# EAGLE schematic PineWoodDerby-Mega_Shield (EAGLE 7.2.0)
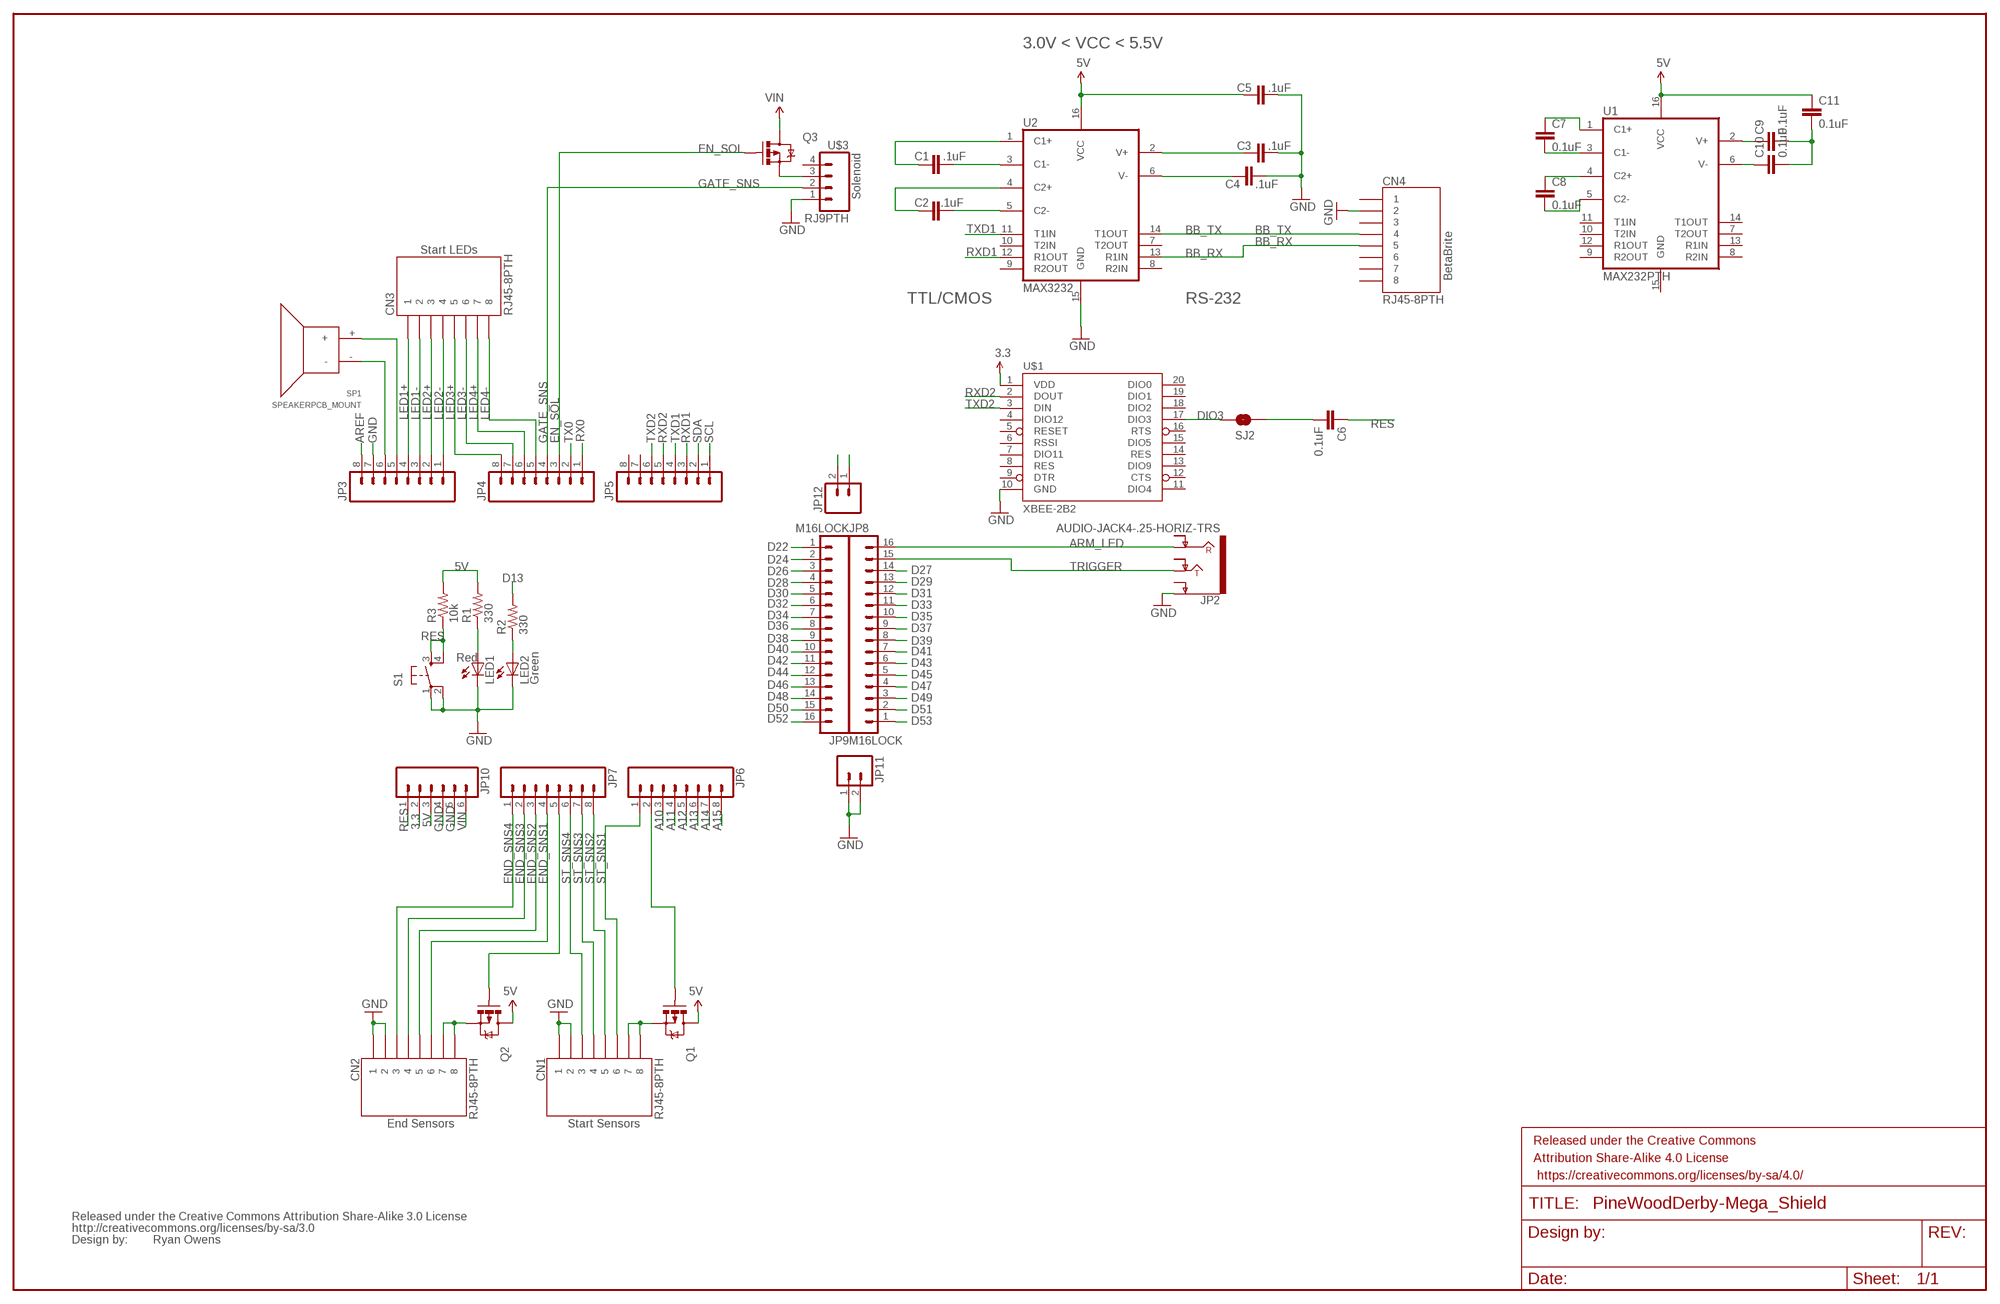
[diagram p0: schematic, sheet 1]

## Parts
C1  .1uF  CAP0402-CAP  [0402-CAP]
C2  .1uF  CAP0402-CAP  [0402-CAP]
C3  .1uF  CAP0402-CAP  [0402-CAP]
C4  .1uF  CAP0402-CAP  [0402-CAP]
C5  .1uF  CAP0402-CAP  [0402-CAP]
C6  0.1uF  CAP0402-CAP  [0402-CAP]
C7  0.1uF  0.1UF-50V-20%(PTH)KIT-EZ  [CAP-PTH-SMALL-KIT]
C8  0.1uF  0.1UF-50V-20%(PTH)KIT-EZ  [CAP-PTH-SMALL-KIT]
C9  0.1uF  0.1UF-50V-20%(PTH)KIT-EZ  [CAP-PTH-SMALL-KIT]
C10  0.1uF  0.1UF-50V-20%(PTH)KIT-EZ  [CAP-PTH-SMALL-KIT]
C11  0.1uF  0.1UF-50V-20%(PTH)KIT-EZ  [CAP-PTH-SMALL-KIT]
CN1  RJ45-8PTH  [RJ45-8]
CN2  RJ45-8PTH  [RJ45-8]
CN3  RJ45-8PTH  [RJ45-8]
CN4  RJ45-8PTH  [RJ45-8]
FRAME2  FRAME-LEDGER  [CREATIVE_COMMONS]
JP2  AUDIO-JACK4-.25-HORIZ-TRS  [AUDIO-JACK-.25-INCH-HORIZ-PTH]
JP3  M08LOCK  [1X08_LOCK]
JP4  M08LOCK  [1X08_LOCK]
JP5  M08LOCK  [1X08_LOCK]
JP6  M08LOCK  [1X08_LOCK]
JP7  M08LOCK  [1X08_LOCK]
JP8  M16LOCK  [1X16_LOCK]
JP9  M16LOCK  [1X16_LOCK]
JP10  M06LOCK  [1X06_LOCK]
JP11  M02LOCK  [1X02_LOCK]
JP12  M02LOCK  [1X02_LOCK]
LED1  Red  LED5MM  [LED5MM]
LED2  Green  LED5MM  [LED5MM]
Q1  MOSFET-PCHANNELFQP27P06  [TO220V]
Q2  MOSFET-PCHANNELFQP27P06  [TO220V]
Q3  MOSFET-PCHANNELFQP27P06  [TO220V]
R1  330  RESISTORPTH1  [AXIAL-0.3]
R2  330  RESISTORPTH1  [AXIAL-0.3]
R3  10k  RESISTORPTH1  [AXIAL-0.3]
S1  TAC_SWITCHPTH  [TACTILE-PTH]
SJ2  SOLDERJUMPERTRACE  [SJ_2S-TRACE]
SP1  SPEAKERPCB_MOUNT  [PCB_MOUNT_SPEAKER]
U1  MAX232PTH  [DIL16]
U2  MAX3232  MAX232SOIC16  [SO016]
U$1  XBEE-2B2  [XBEE-SILK]
U$2  CREATIVE_COMMONS  [CREATIVE_COMMONS]
U$3  RJ9PTH  [RJ9]

## Nets
3.3: JP10.2 U$1.1(VDD)
5V: C5.1 C11.1 JP10.3 Q1.2(D) Q2.2(D) R1.P$2 R3.P$2 U1.16(VCC) U2.16(VCC)
5V@1: JP12.1 JP12.2
A10: JP6.3
A11: JP6.4
A12: JP6.5
A13: JP6.6
A14: JP6.7
A15: JP6.8
AREF: JP3.8
ARM_LED: JP2.RING JP8.16
BB_RX: CN4.5 U2.13(R1IN)
BB_TX: CN4.4 U2.14(T1OUT)
C1+: C1.1 U2.1(C1+)
C1-: C1.2 U2.3(C1-)
C2+: C2.1 U2.4(C2+)
C2-: C2.2 U2.5(C2-)
D13: R2.P$2
D22: JP9.1
D24: JP9.2
D26: JP9.3
D27: JP8.14
D28: JP9.4
D29: JP8.13
D30: JP9.5
D31: JP8.12
D32: JP9.6
D33: JP8.11
D34: JP9.7
D35: JP8.10
D36: JP9.8
D37: JP8.9
D38: JP9.9
D39: JP8.8
D40: JP9.10
D41: JP8.7
D42: JP9.11
D43: JP8.6
D44: JP9.12
D45: JP8.5
D46: JP9.13
D47: JP8.4
D48: JP9.14
D49: JP8.3
D50: JP9.15
D51: JP8.2
D52: JP9.16
D53: JP8.1
DIO3: SJ2.2 U$1.17(DIO3)
EN_END_SNS: JP7.5 Q2.1(G)
EN_SOL: JP4.3 Q3.1(G)
EN_ST_SNS: JP6.2 Q1.1(G)
END_SNS1: CN2.6 JP7.4
END_SNS2: CN2.5 JP7.3
END_SNS3: CN2.4 JP7.2
END_SNS4: CN2.3 JP7.1
GATE_SNS: JP4.4 U$3.2
GND: C3.2 C4.2 C5.2 CN1.1 CN1.2 CN2.1 CN2.2 CN4.2 JP2.SLEEVE(EARTH) JP3.7 JP10.4 JP10.5 JP11.1 JP11.2 LED1.K(C) LED2.K(C) S1.1 S1.2 U2.15(GND) U$1.10(GND) U$3.1
LED1+: CN3.1 JP3.4
LED1-: CN3.2 JP3.3
LED2+: CN3.3 JP3.2
LED2-: CN3.4 JP3.1
LED3+: CN3.5 JP4.8
LED3-: CN3.6 JP4.7
LED4+: CN3.7 JP4.6
LED4-: CN3.8 JP4.5
N$1: JP3.5 SP1.+
N$2: JP3.6 SP1.-
N$3: C7.1 U1.1(C1+)
N$4: C7.2 U1.3(C1-)
N$5: C6.2 SJ2.1
N$6: C8.1 U1.4(C2+)
N$7: C8.2 U1.5(C2-)
N$8: C9.2 C10.2 C11.2
N$9: C10.1 U1.6(V-)
N$10: C9.1 U1.2(V+)
N$11: CN2.7 CN2.8 Q2.3(S)
N$12: CN1.7 CN1.8 Q1.3(S)
N$60: Q3.3(S) U$3.3
N$126: LED1.A R1.P$1
N$127: LED2.A R2.P$1
RES: C6.1 JP10.1 R3.P$1 S1.3 S1.4
RX0: JP4.1
RXD1: JP5.3 U2.12(R1OUT)
RXD2: JP5.5 U$1.2(DOUT)
SCL: JP5.1
SDA: JP5.2
ST_SNS1: CN1.6 JP6.1
ST_SNS2: CN1.5 JP7.8
ST_SNS3: CN1.4 JP7.7
ST_SNS4: CN1.3 JP7.6
TRIGGER: JP2.TIP JP8.15
TX0: JP4.2
TXD1: JP5.4 U2.11(T1IN)
TXD2: JP5.6 U$1.3(DIN)
V+: C3.1 U2.2(V+)
V-: C4.1 U2.6(V-)
VIN: JP10.6 Q3.2(D)
Unconnected: CN4.1 CN4.3 CN4.6 CN4.7 CN4.8 JP2.RING-NORM JP2.SLEEVE-NORM(EARTH-NORM) JP2.TIP-NORM JP5.7 JP5.8 U1.7(T2OUT) U1.8(R2IN) U1.9(R2OUT) U1.10(T2IN) U1.11(T1IN) U1.12(R1OUT) U1.13(R1IN) U1.14(T1OUT) U1.15(GND) U2.7(T2OUT) U2.8(R2IN) U2.9(R2OUT) U2.10(T2IN) U$1.4(DIO12) U$1.5(RESET) U$1.6(RSSI) U$1.7(DIO11) U$1.8(RES) U$1.9(DTR) U$1.11(DIO4) U$1.12(CTS) U$1.13(DIO9) U$1.14(RES) U$1.15(DIO5) U$1.16(RTS) U$1.18(DIO2) U$1.19(DIO1) U$1.20(DIO0) U$3.4

## Notes on the sheet
- 3.0V < VCC < 5.5V
- TTL/CMOS | RS-232
- Ryan Owens

## Library data of the parts
C1-C5 = SparkFun-Passives:CAP: Capacitor Standard 0603 ceramic capacitor, and 0.1" leaded capacitor.; PROD_ID: CAP-00810; SPARKLE_ID: 918
C6 = SparkFun:CAP: Capacitor Standard 0603 ceramic capacitor, and 0.1" leaded capacitor.
C7-C11 = SparkFun-Capacitors:0.1UF-50V-20%(PTH): CAP-08370; PROD_ID: CAP-08370
CN1 = SparkFun-Connectors:RJ45-8: RJ45 Jack Simple RJ45, 8-pin connection - connector for common Cat5, Cat5e, and Cat6 Ethernet cables. Footprint not yet proven in production. Connector sku is PRT-00643; Breakout PCB sku is BOB-00716.; LABEL: Start Sensors
CN2 = SparkFun-Connectors:RJ45-8: RJ45 Jack Simple RJ45, 8-pin connection - connector for common Cat5, Cat5e, and Cat6 Ethernet cables. Footprint not yet proven in production. Connector sku is PRT-00643; Breakout PCB sku is BOB-00716.; LABEL: End Sensors
CN3 = SparkFun-Connectors:RJ45-8: RJ45 Jack Simple RJ45, 8-pin connection - connector for common Cat5, Cat5e, and Cat6 Ethernet cables. Footprint not yet proven in production. Connector sku is PRT-00643; Breakout PCB sku is BOB-00716.; LABEL: Start LEDs
CN4 = SparkFun-Connectors:RJ45-8: RJ45 Jack Simple RJ45, 8-pin connection - connector for common Cat5, Cat5e, and Cat6 Ethernet cables. Footprint not yet proven in production. Connector sku is PRT-00643; Breakout PCB sku is BOB-00716.; LABEL: BetaBrite
FRAME2 = SparkFun-Aesthetics:FRAME-LEDGER: Schematic Frame Standard 11x14 US Ledger frame
JP2 = SparkFun-Connectors:AUDIO-JACK4-.25-HORIZ-TRS: 1/4" TRS jack, horizontal Production SKU: COM-11144 Footprint unproven - datasheet and part seem to be slightly different; PROD_ID: COM-11144
JP3-JP7 = SparkFun:M08: Header 8 Standard 8-pin 0.1" header. Use with straight break away headers (SKU : PRT-00116), right angle break away headers (PRT-00553), swiss pins (PRT-00743), machine pins (PRT-00117), and female headers (PRT-00115).
JP8 JP9 = SparkFun:M16
JP10 = SparkFun:M06: Header 6 Standard 6-pin 0.1" header. Use with straight break away headers (SKU : PRT-00116), right angle break away headers (PRT-00553), swiss pins (PRT-00743), machine pins (PRT-00117), and female headers (PRT-00115). Molex polarized connector foot print use with SKU : PRT-08094 with associated crimp pins and housings. NOTES ON THE VARIANTS LOCK and LOCK_LONGPADS... This footprint was designed to help hold the alignment of a through-hole component (i.e. 6-pin header) while soldering it into place. You may notice that each hole has been shifted either up or down by 0.005 of an inch from it's more standard position (which is a perfectly straight line). This slight alteration caused the pins (the squares in the middle) to touch the edges of the holes. Because they are alternating, it causes a "brace" to hold the component in place. 0.005 has proven to be the perfect amount of "off-center" position when using our standard breakaway headers. Although looks a little odd when you look at the bare footprint, once you have a header in there, the alteration is very hard to notice. Also, if you push a header all the way into place, it is covered up entirely on the bottom side. This idea of altering the position of holes to aid alignment will be further integrated into the Sparkfun Library for other footprints. It can help hold any component with 3 or more connection pins.
JP11 JP12 = SparkFun:M02: Header 2 Standard 2-pin 0.1" header. Use with straight break away headers (SKU : PRT-00116), right angle break away headers (PRT-00553), swiss pins (PRT-00743), machine pins (PRT-00117), and female headers (PRT-00115). Molex polarized connector foot print use with SKU : PRT-08233 with associated crimp pins and housings.
LED1 LED2 = SparkFun:LED: LEDs Standard schematic elements and footprints for 5mm, 3mm, 1206, and 0603 sized LEDs. 5mm - Spark Fun Electronics SKU : COM-00529 (and others)
Q1-Q3 = SparkFun-DiscreteSemi:MOSFET-PCHANNEL: Generic PMOSFET IRLML2244 - TRANS-11153 (SOT-23 -20V -4.3A) (1.Gate 2.Source 3.Drain) FQP27P06 - COM-10349 <http://www.sparkfun.com/products/10349> (TO-220 -60V -27A) (1.Gate 2.Source 3.Drain)
R1-R3 = SparkFun:RESISTOR: Resistor Basic schematic elements and footprints for 0603, 1206, and PTH 1/10th watt (small) resistors.
S1 = SparkFun:TAC_SWITCH: Momentary Switch Button commonly used for reset or general input. Spark Fun Electronics SKU : COM-00097
SJ2 = SparkFun:SOLDERJUMPER: Solder Jumper Standard SMD solder jumper. Used to automate production. Two varients : Normally Open and Normally Closed are the same, but have different paste layers. NC will have a large amount of paste and should jumper during reflow.
SP1 = SparkFun-Electromechanical:SPEAKER: General speakers.; MFG: SANCO; PROD_#: NA; SKU: COM-11089; SPARKLE_ID: 6504
U1 = SparkFun-DigitalIC:MAX232: RS232 Transceiver Very common IC. This is generically called 'MAX232', but works with the 3V equivalent MAX3232 generic ICs. Field tested and mother approved. Spark Fun Electronics SKU : COM-00316 (DIP) and COM-00589 (SMD)
U2 = SparkFun-DigitalIC:MAX232: RS232 Transceiver Very common IC. This is generically called 'MAX232', but works with the 3V equivalent MAX3232 generic ICs. Field tested and mother approved. Spark Fun Electronics SKU : COM-00316 (DIP) and COM-00589 (SMD); PROD_ID: IC-08171
U$1 = SparkFun-RF:XBEE-2: Xbee module footprints SMT header is CONN-09042.
U$2 = SparkFun:CREATIVE_COMMONS
U$3 = SparkFun-Connectors:RJ9: RJ9 connector (e.g., phone handsets); LABEL: Solenoid

## Net classes
0 default: width 0.203 mm